# Altium schematic sheet Sheet1.SchDoc
size A4
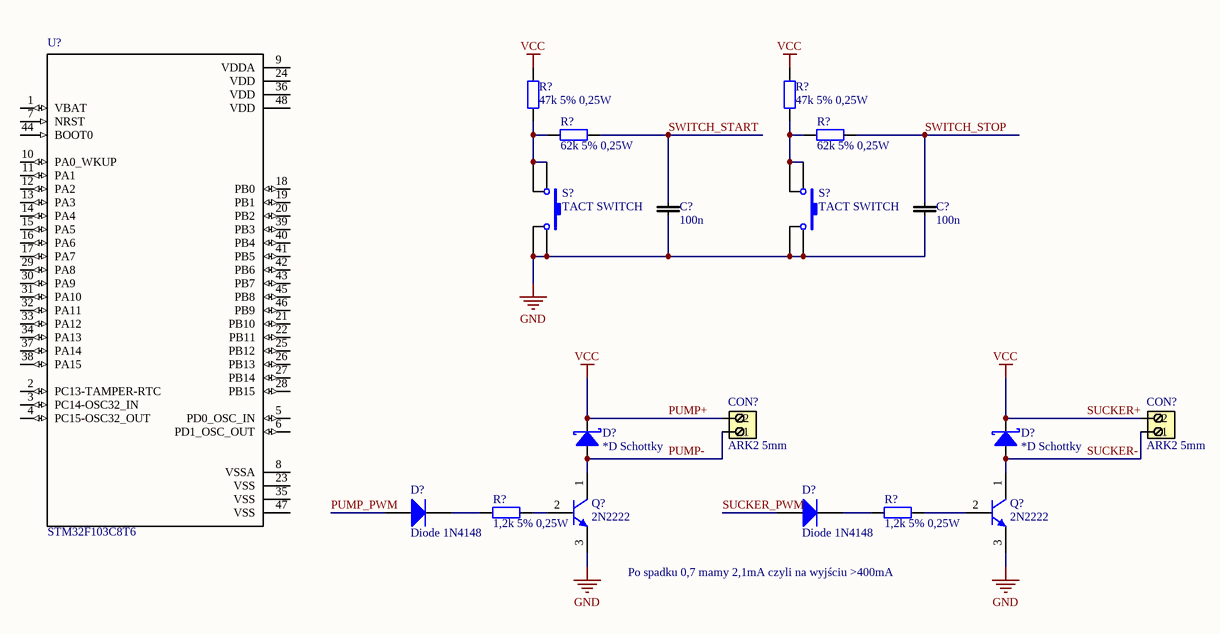
[diagram p0: Sheet1.SchDoc]

## Parts
(Parts that share a designator on the sheet are numbered #1, #2 ... from top to bottom, then left to right.)
C?#1  100n  [C THT  FILM X2]
C?#2  100n  [C THT  FILM X2]
CON?#1  ARK2 5mm  [ARK5-2]
CON?#2  ARK2 5mm  [ARK5-2]
D?#1  *D Schottky  [SMA]
D?#2  *D Schottky  [SMA]
D?#3  Diode 1N4148  [DO-35]
D?#4  Diode 1N4148  [DO-35]
Q?#1  2N2222  [ONSC-TO-92-3-29-11]
Q?#2  2N2222  [ONSC-TO-92-3-29-11]
R?#1  47k 5% 0,25W  [RES-15mm_0.25W]
R?#2  47k 5% 0,25W  [RES-15mm_0.25W]
R?#3  62k 5% 0,25W  [RES-15mm_0.25W]
R?#4  62k 5% 0,25W  [RES-15mm_0.25W]
R?#5  1,2k 5% 0,25W  [RES-15mm_0.25W]
R?#6  1,2k 5% 0,25W  [RES-15mm_0.25W]
S?#1  TACT SWITCH  [DTS6]
S?#2  TACT SWITCH  [DTS6]
U?  STM32F103C8T6  [*QFP50P900X900X160-48N]

## Nets
GND: C?#1.1 C?#2.1 Q?#1.3(E) Q?#2.3(E) S?#1.3 S?#1.4 S?#2.3 S?#2.4
PUMP+: CON?#1.2 CON?#2.2 D?#1.2(K) D?#2.2(K) R?#1.2 R?#2.2  [also labelled SUCKER+, VCC]
PUMP-: CON?#1.1 D?#1.1(A) Q?#1.1(C)
PUMP_PWM: D?#3.1(A)
SUCKER-: CON?#2.1 D?#2.1(A) Q?#2.1(C)
SUCKER_PWM: D?#4.1(A)
SWITCH_START: C?#1.2 R?#3.2
SWITCH_STOP: C?#2.2 R?#4.2
NetD?#3_2: D?#3.2(K) R?#5.1
NetD?#4_2: D?#4.2(K) R?#6.1
NetQ?#1_2: Q?#1.2(B) R?#5.2
NetQ?#2_2: Q?#2.2(B) R?#6.2
NetR?#1_1: R?#1.1 R?#3.1 S?#1.1 S?#1.2
NetR?#2_1: R?#2.1 R?#4.1 S?#2.1 S?#2.2

Not connected (* = marked no-connect by the designer): U? 1(VBAT) 2(PC13-TAMPER-RTC) 3(PC14-OSC32_IN) 4(PC15-OSC32_OUT) 5(PD0_OSC_IN) 6(PD1_OSC_OUT) 7(NRST) 8(VSSA) 9(VDDA) 10(PA0_WKUP) 11(PA1) 12(PA2) 13(PA3) 14(PA4) 15(PA5) 16(PA6) 17(PA7) 18(PB0) 19(PB1) 20(PB2) 21(PB10) 22(PB11) 23(VSS) 24(VDD) 25(PB12) 26(PB13) 27(PB14) 28(PB15) 29(PA8) 30(PA9) 31(PA10) 32(PA11) 33(PA12) 34(PA13) 35(VSS) 36(VDD) 37(PA14) 38(PA15) 39(PB3) 40(PB4) 41(PB5) 42(PB6) 43(PB7) 44(BOOT0) 45(PB8) 46(PB9) 47(VSS) 48(VDD)

## Notes on the sheet
- Po spadku 0,7 mamy 2,1mA czyli na wyjściu >400mA

## Library data of the parts
C?#1 C?#2 = *C THT: Film Capacitor; Publisher: Kamil Pawliczak; Value: 100n; HelpURL: C:\Altium\Biblioteki\elementy_bierne\doc\kondensator.txt
CON?#1 CON?#2 = ARK2 5mm: ARK2 CONNECTOR; Class: U; PN Piekarz: 00561; Preferred shop: Piekarz; PN Other: *; PN TME: EBBA-02-C-SS-BU; Publisher: NXT Labs; Type: CON
D?#1 D?#2 = *D Schottky: Schottky Diode; Publisher: Kamil Pawliczak
D?#3 D?#4 = Diode 1N4148: High Conductance Fast Diode; Published: 8-Jun-2000; LatestRevisionDate: 17-Jul-2002; LatestRevisionNote: Re-released for DXP Platform.; DatasheetVersion: 1997; PackageReference: DO-35; Publisher: Altium Limited; PackageDescription: Diode, Axial; Body 3.8 x 1.9 mm (LxDia. max), Lead Dia. 0.53 mm (max); Code_JEDEC: DO-204-AH; ComponentLink1Description: Manufacturer Link; ComponentLink1URL: http://www.fairchildsemi.com/; ComponentLink2Description: Datasheet; ComponentLink2URL: http://www.fairchildsemi.com/ds/1N%2F1N4148.pdf
Q?#1 Q?#2 = CMP-1048-01402-1: Amplifier Transistor, NPN Silicon, 3-Pin TO-92, Pb-Free, Bulk Box; PartNumber: P2N2222AG; Manufacturer: On Semiconductor; IC Continuous (A): 0.6; fT Min (MHz): 300; ComponentLink2Description: Datasheet; ComponentLink1Description: Manufacturer URL; ComponentLink2URL: http://www.onsemi.com/pub_link/Collateral/P2N2222A-D.PDF; ComponentLink3Description: Package Specification; RoHS: TRUE; ComponentLink1URL: http://www.onsemi.com/; Mounting Technology: Through Hole; PackageReference: TO-92-3-29-11_AM_SL; Polarity: NPN; Packing: Bulk Box; DatasheetVersion: Rev. 7; PackageDescription: 3-Pin Transistor Outline, Body 4.825 x 3.685 mm, Pitch 1.27 mm; PackageVersion: Rev. AM; ComponentLink3URL: http://www.onsemi.cn/pub_link/Collateral/2N6426-D.PDF
R?#1-R?#6 = 470 5% 0,25W H 15mm: Tht resistor; Value: 470; PN Piekarz: 03311; Preferred shop: P; Class: U; PD: 0,25W; Publisher: NXT Labs; Type: R; PN TME: CF1/4W-470R; PN Other: *; Tolerance: 5%
S?#1 S?#2 = TACT SWITCH: 6x6mm Switch; Publisher: Kamil Pawliczak; ComponentLink1Description: DTS6 - Dokumentacja; ComponentLink1URL: C:\Altium\Biblioteki\elementy_stykowe\doc\dts6.pdf
U? = STM32F103C8T6: Mainstream Performance line, ARM Cortex-M3 MCU with 64 Kbytes Flash, 72 MHz CPU, motor control, USB and CAN; MF: STMicroelectronics; Price: None; MP: STM32F103C8T6; SnapEDA_Link: https://www.snapeda.com/parts/STM32F103C8T6/STMicroelectronics/view-part/?ref=snap; Package: LQFP-48 STMicroelectronics; Availability: Unavailable; Value: *